# Altium project pUFM_Digital_Interface_R0.1.PrjPcb (part 2 of 2)

## Sheet M10-4-20mA.SchDoc
size A4; ApprovedBy: -; CheckedBy: h.t.t.monfared; Author: h.t.t.monfared; Engineer: h.t.t.monfared; Revision: 1.0; SheetNumber: 10; SheetTotal: 10; Project Code:: UFM Sensor Controller; Document Title:: 4-20 mA transmitter Sheet; Material Code: 1.00; ReleasedBy: h.t.t.monfared
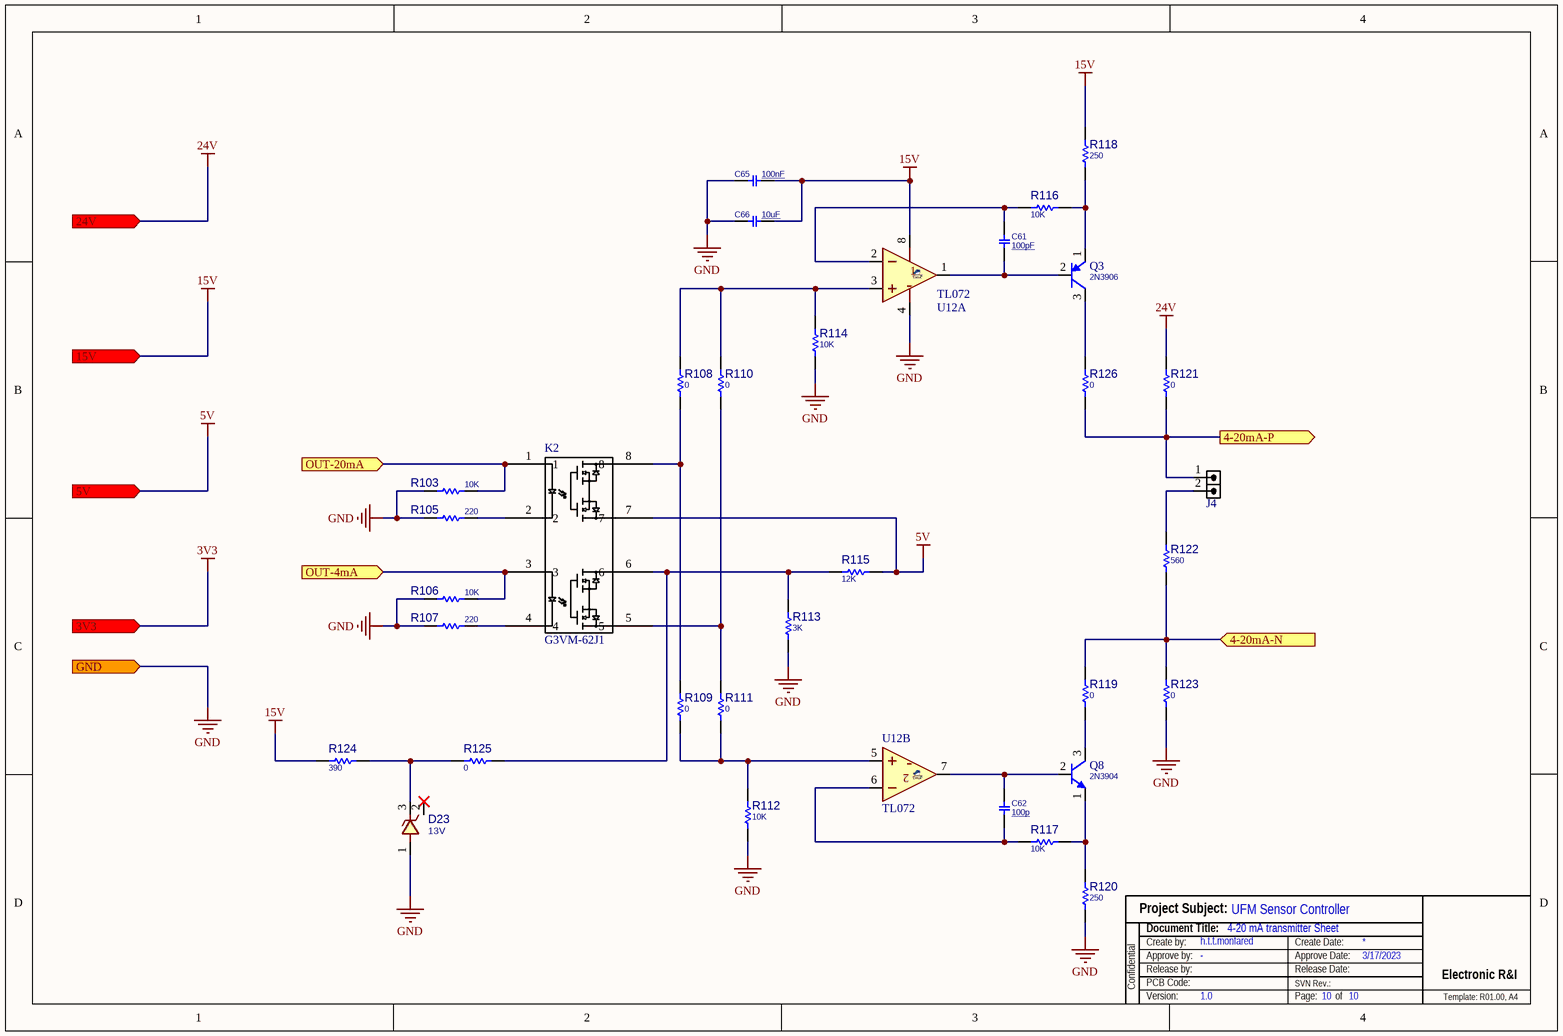
[diagram p10: M10-4-20mA.SchDoc]

### Parts
C61  100pF  [C1206]
C62  100p  [C1206]
C65  100nF  [C1206]
C66  10uF  [C1206]
D23  13V  [SOT23_3]
J4  HDRM2  [HDR_M_1X2]  (value not drawn)
K2  G3VM-62J1  [J-SOP8_OMR]
Q3  2N3906  [TO92_3]
Q8  2N3904  [TO92_3]
R103  10K  [R1206]
R105  220  [R1206]
R106  10K  [R1206]
R107  220  [R1206]
R108  0  [R1206]
R109  0  [R1206]
R110  0  [R1206]
R111  0  [R1206]
R112  10K  [R1206]
R113  3K  [R1206]
R114  10K  [R1206]
R115  12K  [R1206]
R116  10K  [R1206]
R117  10K  [R1206]
R118  250  [R1206]
R119  0  [R1206]
R120  250  [R1206]
R121  0  [R1206]
R122  560  [R1210]
R123  0  [R1206]
R124  390  [R1206]
R125  0  [R1206]
R126  0  [R1206]
U12  TL072  [SO_8]  (parts A,B of 2)

### Ports
3V3 (in), 4-20mA-N (in), 4-20mA-P (out), 5V (in), 15V (in), 24V (in), GND (in), OUT-4mA (in), OUT-20mA (in)

### Nets
5V: K2.7 R115.1 ; port 5V
15V: C65.2 C66.2 R118.2 R124.1 U12.8(V+) ; port 15V
24V: R121.2 ; port 24V
GND: C65.1 C66.1 D23.1 R103.2 R105.1 R106.2 R107.1 R112.1 R113.2 R114.1 R120.1 R123.1 U12.4(V-) ; port GND
OUT-4mA: K2.3 R106.1 ; port OUT-4mA
OUT-20mA: K2.1 R103.1 ; port OUT-20mA
Net4-20mA_1: J4.1 R121.1 R126.1 ; port 4-20mA-P
Net4-20mA_2: R119.2 R122.1 R123.2 ; port 4-20mA-N
NetC61_1: C61.1 Q3.2(B) U12.1(OUT1)
NetC61_2: C61.2 R116.1 U12.2(IN1-)
NetC62_1: C62.1 R117.2 U12.6(IN2-)
NetC62_2: C62.2 Q8.2(B) U12.7(OUT2)
NetD23_3: D23.3 R124.2 R125.1
NetJ4_2: J4.2 R122.2
NetK2_2: K2.2 R105.2
NetK2_4: K2.4 R107.2
NetK2_5: K2.5 R110.1 R111.2
NetK2_6: K2.6 R113.1 R115.2 R125.2
NetK2_8: K2.8 R108.1 R109.2
NetQ3_1: Q3.1(E) R116.2 R118.1
NetQ3_3: Q3.3(C) R126.2
NetQ8_1: Q8.1(E) R117.1 R120.2
NetQ8_3: Q8.3(C) R119.1
NetR108_2: R108.2 R110.2 R114.2 U12.3(IN2+)
NetR109_1: R109.1 R111.1 R112.2 U12.5(IN2+)

Not connected (* = marked no-connect by the designer): D23 2*

### Notes on the sheet
- Project Subject:
- Confidential
- Release by:
- Document Title:
- Create by:
- PCB Code:
- Approve by:
- SVN Rev.:
- Create Date:
- Release Date:
- Approve Date:
- Electronic R&I
- Version:
- Page:
- of
- Template: R01.00, A4

### Library data of the parts
C61 C62 C65 C66 = CAP_SMD_MLCC: CAP, MLCC, 1nF, 50V, C0G, 10%, 0402; MANF_P#: MANF_PART#; MANF: Murata; PARAM: C0G, 10%; PRICE: 100= 1$; DESC: CAP, MLCC, 1nF, 50V, C0G, 10%, 0402; PARAM2: 50V; ASSEMBLY: ASSEMBLY
  C61: VALUE: 100pF
  C62: VALUE: 100p
  C65: VALUE: 100nF
  C66: VALUE: 10uF
D23 = DIODE_SMD_ZENER_BZX84-C12: DIODE, ZENER, 0.25W, 12.7V; MANF: NXP; DESC: DESCRIPTION; PARAM2: 12.7V, 0.9VF; PARAM: 0.25W, 10mA IF; ASSEMBLY: ASSEMBLY; PRICE: PRICE; MANF_P#: BZX84-C12; VALUE: 13V
J4 = HDR_M_1X2: CONN, HEADER, Male, pitch: 2.54mm, 2POS; VALUE: HDRM2
K2 = G3VM-62J1: No Description Available; Mfr_Name: Omron; RefDes: RefDes; Type: Type
Q3 = PNP_2N3906_TO92: BJT, PNP, 40v, 0.6A, THD, TO92; PARAM: 40v, 0.2A; PARAM2: 625mW; MANF: ST; MANF_P#: 2N3906; VALUE: 2N3906
Q8 = NPN_2N3904_TO92: BJT, NPN, 40v, 0.6A, THD, TO92; PARAM: 40v, 0.2A; PARAM2: 625mW; MANF: ST; MANF_P#: 2N3904; VALUE: 2N3904
R103 R105-R126 = RES_SMD: RESISTOR, SMD; PARAM: -W; DESC: DESCRIPTION; DIST#: MOUSER; PARAM2: 1%; MANF_P#: -; MANF: -; ASSEMBLY: ASSEMBLY; PRICE: 100= 0.5$
  R103 R106 R112 R114 R116 R117: VALUE: 10K
  R105 R107: VALUE: 220
  R108-R111 R119 R121 R123 R125 R126: VALUE: 0
  R113: VALUE: 3K
  R115: VALUE: 12K
  R118 R120: VALUE: 250
  R122: VALUE: 560
  R124: VALUE: 390
U12 = TL072_SOP8: AMP, Dual, Lo-Noise, JFET Input; MANF: Texas Instruments; MANF_P#: TL072CDR, TL072IDR; VALUE: TL072

## Nets that join several sheets
3V3: M1-MCU (27 pins), M8-LDO_3.3V (5 pins), M3-LCD (5 pins), M4-Comprator (C45.1 C46.1 U9.1 U9.8), M9-PowerMeas (5 pins)
5V: M1-MCU (R24.2), M7-Buck_5V (5 pins), M8-LDO_3.3V (C33.2 U5.1), M3-LCD (R93.2), M2-RS485 (R49.2 R54.2), M10-4-20mA (K2.7 R115.1)
15V: M6-Buck_15V (6 pins), M7-Buck_5V (C4.1 C6.1 R6.2 U4.2), M5-RelayDriver (D9.2 K1.1 R40.1 R42.2), M3-LCD (C38.2 C39.2 U11.1), M4-Comprator (11 pins), M10-4-20mA (5 pins)
24V: MainSheet (F2.2), M6-Buck_15V (D21.1), M10-4-20mA (R121.2)
GND: MainSheet (CONV-IN.2 DC_IN.1 DC_IN.2 TM1.3), M1-MCU (49 pins), M6-Buck_15V (15 pins), M7-Buck_5V (13 pins), M8-LDO_3.3V (10 pins), M5-RelayDriver (7 pins), M3-LCD (8 pins), M2-RS485 (8 pins), M4-Comprator (21 pins), M9-PowerMeas (5 pins), M10-4-20mA (13 pins)
DPOT_CS: M1-MCU (U2.14), M4-Comprator (U9.12)
DPOT_MISO: M1-MCU (J3.7 R13.1 U2.16), M4-Comprator (U9.13)
DPOT_RDY: M1-MCU (R97.2), M4-Comprator (U9.14)
LCD_CS: M1-MCU (U2.12), M3-LCD (R91.1)
LCD_CS2: M1-MCU (R98.2), M3-LCD (R37.2)
LCD_DC: M1-MCU (U2.39), M3-LCD (R90.1)
LCD_FSO: M1-MCU (U2.40), M3-LCD (R36.2)
LCD_MOSI: MainSheet (R100.1), M3-LCD (P_OLED.4 R38.2)
LCD_RES: M1-MCU (U2.38), M3-LCD (R89.1)
LCD_SCLK: MainSheet (R101.1), M3-LCD (P_OLED.3 R39.2)
MOSI: MainSheet (R100.2), M1-MCU (R104.2), M4-Comprator (U9.10)
Net4-20mA_1: MainSheet (4-20mA.1), M10-4-20mA (J4.1 R121.1 R126.1)
Net4-20mA_2: MainSheet (4-20mA.2), M10-4-20mA (R119.2 R122.1 R123.2)
NetC43_2: MainSheet (RS485.2), M2-RS485 (5 pins)
NetC44_1: MainSheet (RS485.1), M2-RS485 (5 pins)
NetD15_2: MainSheet (R78.1), M5-RelayDriver (D15.2 Q6.4 R46.2)
NetK1_3: MainSheet (Relay.1), M5-RelayDriver (K1.3 K1.6)
NetK1_4: MainSheet (Relay.2), M5-RelayDriver (K1.4 K1.5)
NetPowerMeas_IN_1: MainSheet (PowerMeas_IN.1), M9-PowerMeas (R71.2)
NetPowerMeas_IN_2: MainSheet (PowerMeas_IN.2), M9-PowerMeas (R71.4)
NetR9_1: MainSheet (TM1.2), M1-MCU (R9.1), M4-Comprator (R60.1)
NetR41_1: MainSheet (R76.2 R77.2), M5-RelayDriver (R41.1)
NetR69_2: MainSheet (R79.1), M4-Comprator (R69.2)
NetR70_1: MainSheet (R76.1), M4-Comprator (R70.1 U10.14)
OUT-4mA: M1-MCU (U2.22), M10-4-20mA (K2.3 R106.1)
OUT-20mA: M1-MCU (U2.21), M10-4-20mA (K2.1 R103.1)
PIG_DET: M1-MCU (U2.18), M5-RelayDriver (Q7.1)
PM_SCL: M1-MCU (U2.45), M9-PowerMeas (R74.1 U1.5)
PM_SDA: M1-MCU (U2.46), M9-PowerMeas (R75.1 U1.6)
REL_OUT: MainSheet (R77.1), M1-MCU (U2.19)
SCK: MainSheet (R101.2), M1-MCU (R102.2), M4-Comprator (U9.11)
URx: M1-MCU (U2.31), M2-RS485 (R50.1)
UTE: M1-MCU (U2.29), M2-RS485 (R47.1)
UTx: M1-MCU (U2.30), M2-RS485 (R51.1)

## Assembly variants
Full: not fitted R76 R79 R85 R86 R87 R88 R93 R94 R98 R103 R105
Discrete: not fitted R77 R78 R85 R86 R87 R88 R93 R94 R98 R103 R105
Final: not fitted C45 C46 C47 C48 C49 C50 C51 C52 C56 D16 D17 D18 D19 D20 R57 R58 R59 R60 R61 R62 R63 R64 R65 R66 R67 R68 R69 R70 R76 R79 R80 R81 R82 R83 R84 R85 R86 R87 R88 R93 R94 R98 R103 R105 U9 U10